# Altium schematic sheet Pedalbox.SchDoc: =DocumentName
size A4; Organization: Queen's Formula SAE; Address1: 130 Stuart St, Kingston; Address2: Ontario; Address3: Canada; Address4: K7L 2V9; DocumentNumber: 1; Revision: 0; SheetNumber: 1; SheetTotal: 1
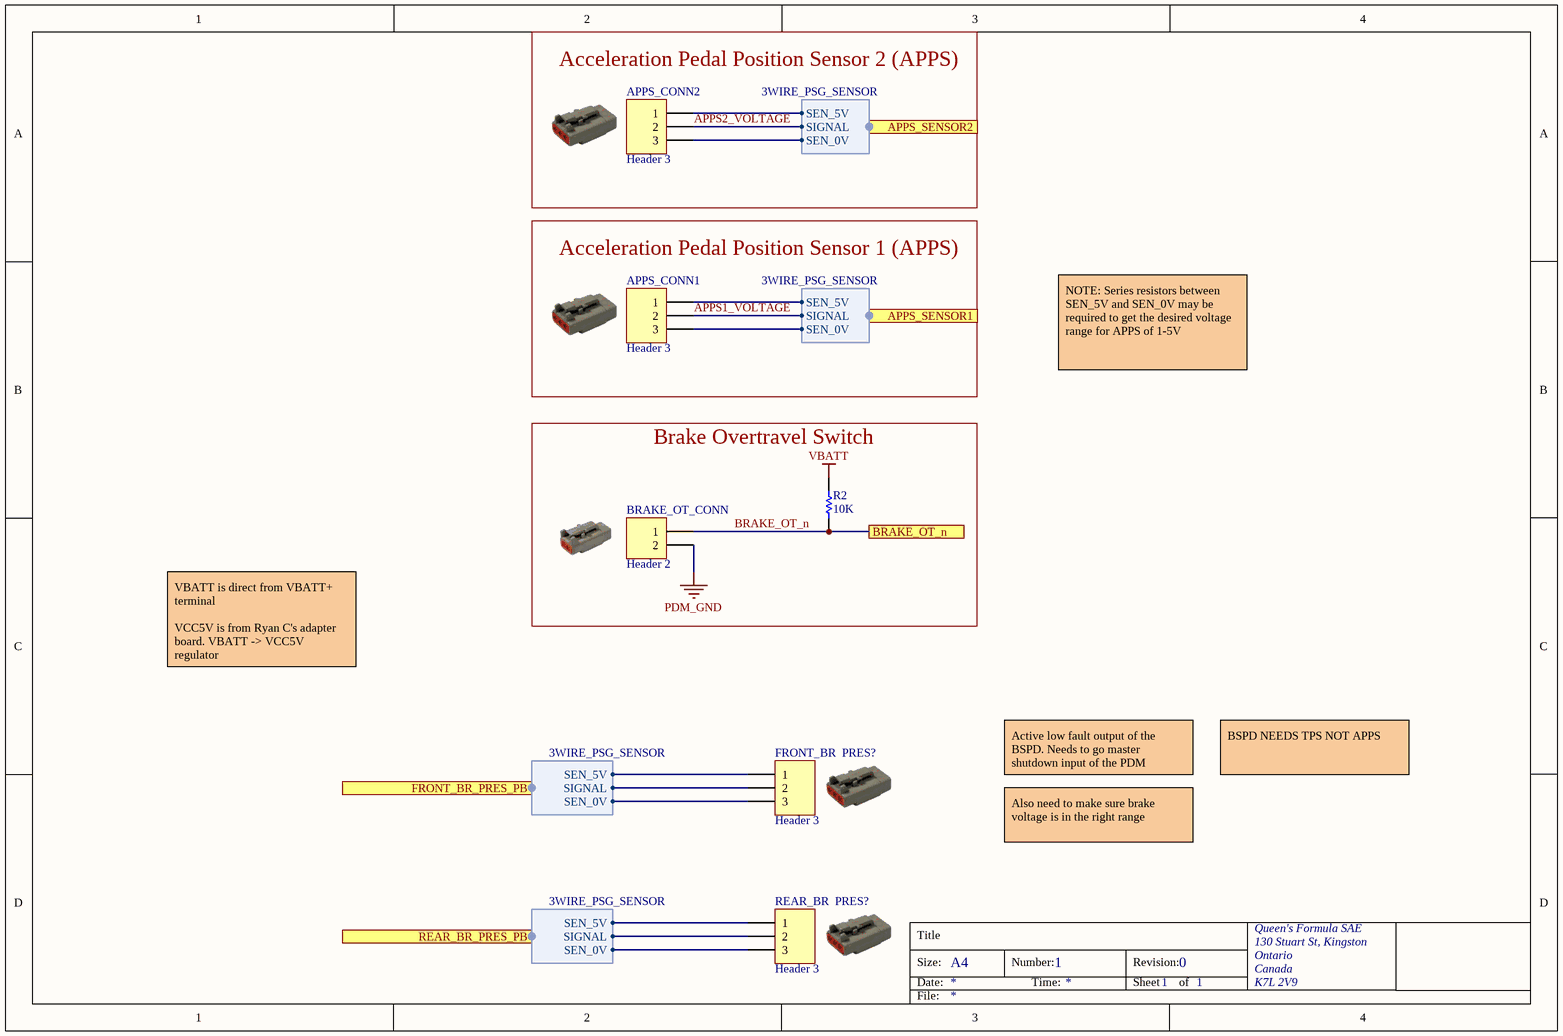
[diagram p0: Pedalbox.SchDoc]

## Parts
APPS_CONN1  Header 3  [HDR1X3]
APPS_CONN2  Header 3  [HDR1X3]
BRAKE_OT_CONN  Header 2  [HDR1X2]
FRONT_BR_PRES?  Header 3  [HDR1X3]
R2  10K  [RESC3216X180X46ML20T20]
REAR_BR_PRES?  Header 3  [HDR1X3]

## Blocks framed on the sheet
Acceleration Pedal Position Sensor 2 (APPS): APPS_CONN2
Acceleration Pedal Position Sensor 1 (APPS): APPS_CONN1
Brake Overtravel Switch: BRAKE_OT_CONN R2

## Ports
APPS_SENSOR1 (harness 3WIRE_PSG_SENSOR), APPS_SENSOR2 (harness 3WIRE_PSG_SENSOR), BRAKE_OT_n, FRONT_BR_PRES_PB (harness 3WIRE_PSG_SENSOR), REAR_BR_PRES_PB (harness 3WIRE_PSG_SENSOR)

## Harnesses
3WIRE_PSG_SENSOR: SEN_5V, SEN_0V, SIGNAL

## Nets
PDM_GND: BRAKE_OT_CONN.2
VBATT: R2.2
APPS1_VOLTAGE: APPS_CONN1.2 ; port APPS_SENSOR1.SIGNAL
APPS2_VOLTAGE: APPS_CONN2.2 ; port APPS_SENSOR2.SIGNAL
BRAKE_OT_n: BRAKE_OT_CONN.1 R2.1 ; port BRAKE_OT_n
NetAPPS_CONN1_1: APPS_CONN1.1 ; port APPS_SENSOR1.SEN_5V
NetAPPS_CONN1_3: APPS_CONN1.3 ; port APPS_SENSOR1.SEN_0V
NetAPPS_CONN2_1: APPS_CONN2.1 ; port APPS_SENSOR2.SEN_5V
NetAPPS_CONN2_3: APPS_CONN2.3 ; port APPS_SENSOR2.SEN_0V
NetFRONT_BR_PRES?_1: FRONT_BR_PRES?.1 ; port FRONT_BR_PRES_PB.SEN_5V
NetFRONT_BR_PRES?_2: FRONT_BR_PRES?.2 ; port FRONT_BR_PRES_PB.SIGNAL
NetFRONT_BR_PRES?_3: FRONT_BR_PRES?.3 ; port FRONT_BR_PRES_PB.SEN_0V
NetREAR_BR_PRES?_1: REAR_BR_PRES?.1 ; port REAR_BR_PRES_PB.SEN_5V
NetREAR_BR_PRES?_2: REAR_BR_PRES?.2 ; port REAR_BR_PRES_PB.SIGNAL
NetREAR_BR_PRES?_3: REAR_BR_PRES?.3 ; port REAR_BR_PRES_PB.SEN_0V

## Notes on the sheet
- NOTE: Series resistors between SEN_5V and SEN_0V may be required to get the desired voltage range for APPS of 1-5V
- VBATT is direct from VBATT+ terminal
  VCC5V is from Ryan C's adapter board. VBATT -> VCC5V regulator
- Active low fault output of the BSPD. Needs to go master shutdown input of the PDM
- BSPD NEEDS TPS NOT APPS
- Also need to make sure brake voltage is in the right range
- Title
- Size:
- Date:
- A4
- Number:
- Time:
- Revision:
- Sheet
- of
- File:

## Library data of the parts
APPS_CONN1 APPS_CONN2 FRONT_BR_PRES? REAR_BR_PRES? = Header 3: Header, 3-Pin; LatestRevisionDate: 17-Jul-2002; LatestRevisionNote: Re-released for DXP Platform.; Publisher: Altium Limited
BRAKE_OT_CONN = Header 2: Header, 2-Pin; LatestRevisionDate: 17-Jul-2002; LatestRevisionNote: Re-released for DXP Platform.; Publisher: Altium Limited
R2 = CMP-2003-04855-1: Part Number: NTHS1206N02N1002KE; Manufacturer: Vishay Dale